# EAGLE design offset_rectifier (EAGLE 6.6.0)
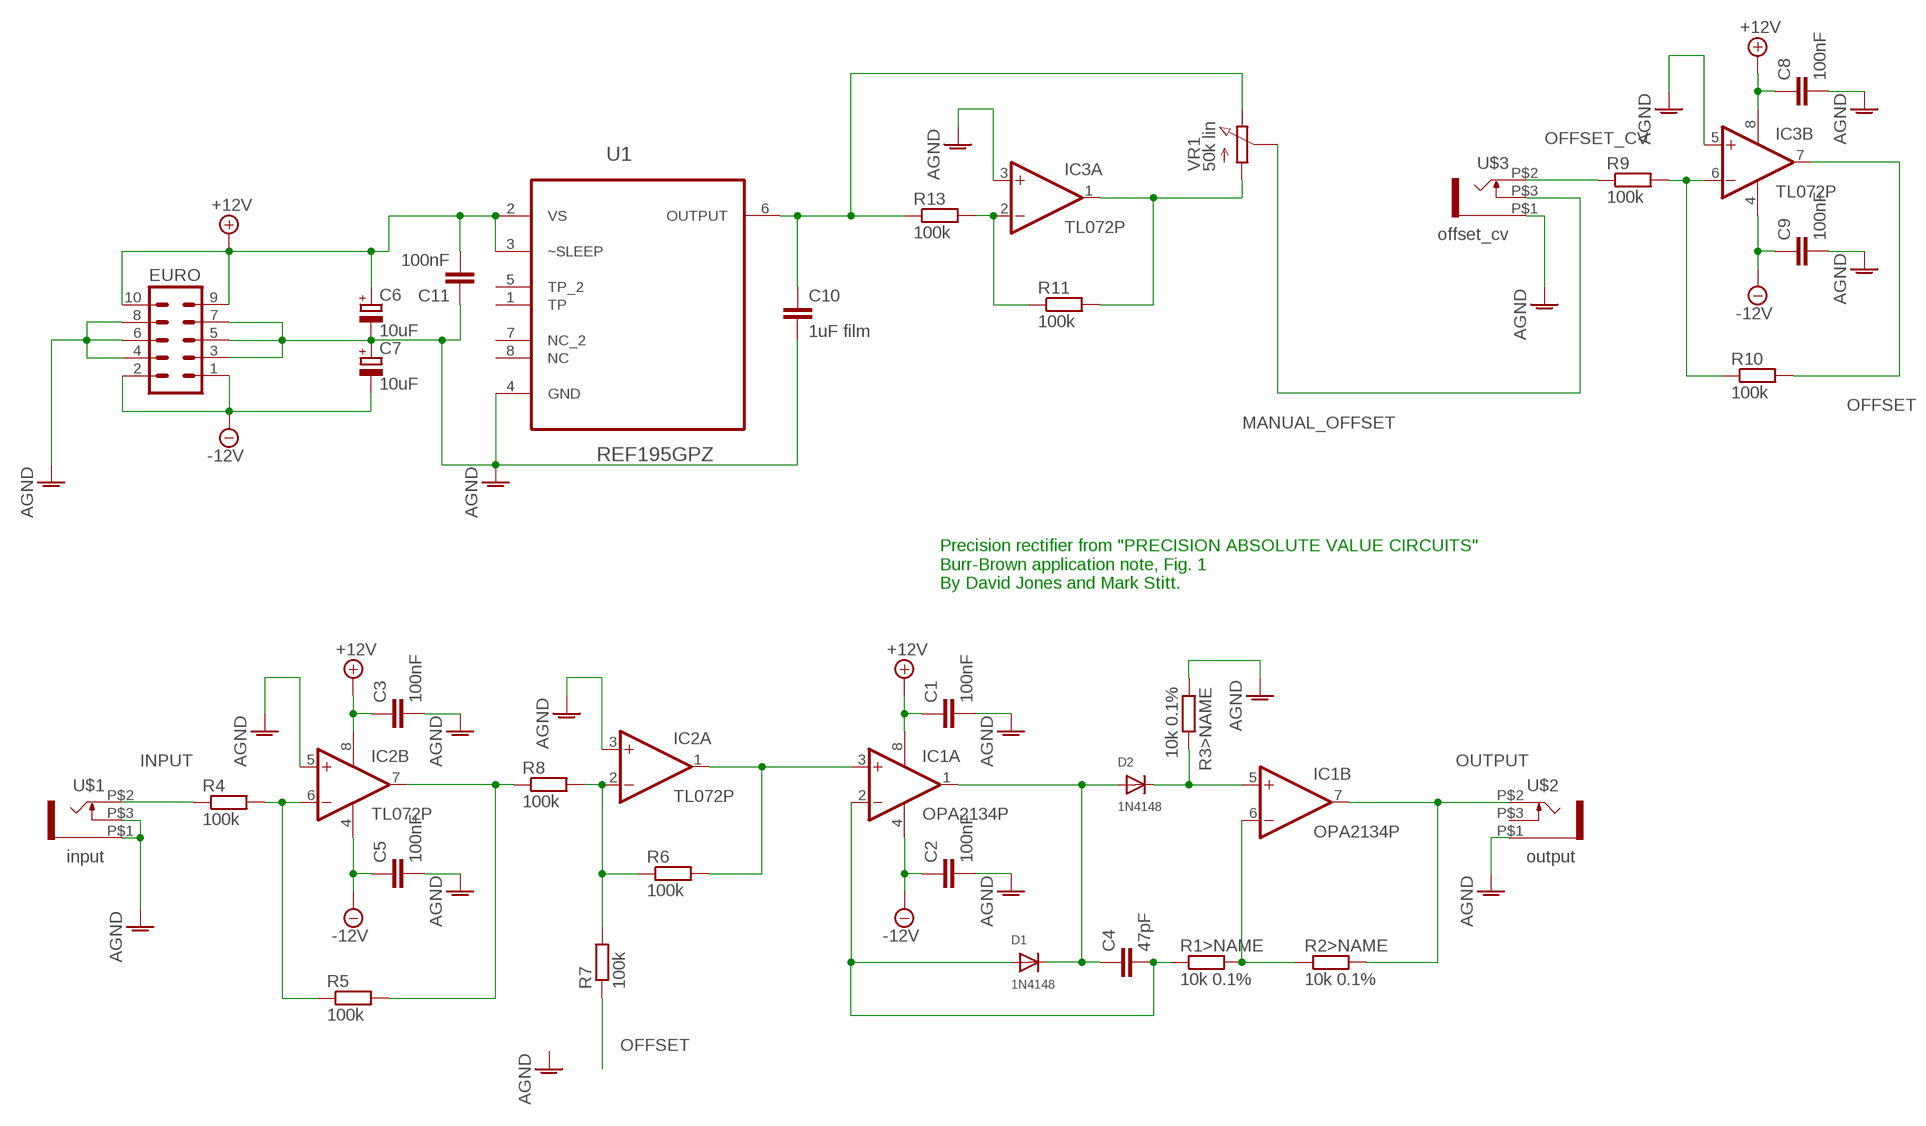
[diagram p0: schematic, sheet 1]

## Parts
C1  100nF  C2,5-3  [C2.5-3]
C2  100nF  C2,5-3  [C2.5-3]
C3  100nF  C2,5-3  [C2.5-3]
C4  47pF  C2,5-3  [C2.5-3]
C5  100nF  C2,5-3  [C2.5-3]
C6  10uF  CPOL-EUE2,5-6E  [E2,5-6E]
C7  10uF  CPOL-EUE2,5-6E  [E2,5-6E]
C8  100nF  C2,5-3  [C2.5-3]
C9  100nF  C2,5-3  [C2.5-3]
C10  1uF film  C-EU050-025X075  [C050-025X075]
C11  100nF  C2,5-3  [C2.5-3]
D1  1N4148  DIODEDO-1N4148  [DO-1N4148]
D2  1N4148  DIODEDO-1N4148  [DO-1N4148]
EURO  MA05-2  [MA05-2]
IC1  OPA2134P  [DIL08]
IC2  TL072P  [DIL08]
IC3  TL072P  [DIL08]
R1  10k 0.1%  WELWYN_PR5  [0409/12.5]
R2  10k 0.1%  WELWYN_PR5  [0409/12.5]
R3  10k 0.1%  WELWYN_PR5  [0409/12.5]
R4  100k  MULTICOMP_MF25  [02.5-06.8/10]
R5  100k  MULTICOMP_MF25  [02.5-06.8/10]
R6  100k  MULTICOMP_MF25  [02.5-06.8/10]
R7  100k  MULTICOMP_MF25  [02.5-06.8/10]
R8  100k  MULTICOMP_MF25  [02.5-06.8/10]
R9  100k  MULTICOMP_MF25  [02.5-06.8/10]
R10  100k  MULTICOMP_MF25  [02.5-06.8/10]
R11  100k  MULTICOMP_MF25  [02.5-06.8/10]
R13  100k  MULTICOMP_MF25  [02.5-06.8/10]
U1  REF195GPZ  [DIP254P762X533-8]
U$1  input  PJ302M-ROUND  [PJ302M]
U$2  output  PJ302M-ROUND  [PJ302M]
U$3  offset_cv  PJ302M-ROUND  [PJ302M]
VR1  50k lin  BI_P09X  [BI_9MM_SIDE]

## Nets
+12V: C1.1 C3.1 C6.+ C8.1 C11.2 EURO.9 EURO.10 IC1.8(P:V+) IC2.8(P:V+) IC3.8(P:V+) U1.2(VS) U1.3(~SLEEP)
-12V: C2.1 C5.1 C7.- C9.1 EURO.1 EURO.2 IC1.4(P:V-) IC2.4(P:V-) IC3.4(P:V-)
AGND: C1.2 C2.2 C3.2 C5.2 C6.- C7.+ C8.2 C9.2 C10.2 C11.1 EURO.3 EURO.4 EURO.5 EURO.6 EURO.7 EURO.8 IC2.3(A:+IN) IC2.5(B:+IN) IC3.3(A:+IN) IC3.5(B:+IN) R3.R$1 U1.4(GND) U$1.P$1(RING) U$1.P$3(SWITCH) U$2.P$1(RING) U$3.P$1(RING)
INPUT: R4.P$1 U$1.P$2(TIP)
MANUAL_OFFSET: U$3.P$3(SWITCH) VR1.WIPER
N$1: IC3.6(B:-IN) R9.P$2 R10.P$1
N$2: C4.2 D1.A IC1.2(A:-IN) R1.R$1
N$3: IC1.3(A:+IN) IC2.1(A:OUT) R6.P$2
N$4: D2.C IC1.5(B:+IN) R3.P$2
N$5: IC2.6(B:-IN) R4.P$2 R5.P$1
N$6: IC1.6(B:-IN) R1.P$2 R2.R$1
N$7: IC3.2(A:-IN) R11.P$1 R13.P$2
N$9: C4.1 D1.C D2.A IC1.1(A:OUT)
N$10: IC3.1(A:OUT) R11.P$2 VR1.BOTTOM
N$11: IC2.2(A:-IN) R6.P$1 R7.P$2 R8.P$2
N$12: IC2.7(B:OUT) R5.P$2 R8.P$1
N$14: C10.1 R13.P$1 U1.6(OUTPUT) VR1.TOP
OFFSET: IC3.7(B:OUT) R7.P$1 R10.P$2
OFFSET_CV: R9.P$1 U$3.P$2(TIP)
OUTPUT: IC1.7(B:OUT) R2.P$2 U$2.P$2(TIP)
Unconnected: U1.1(TP) U1.5(TP_2) U1.7(NC_2) U1.8(NC) U$2.P$3(SWITCH)

## Notes on the sheet
- Precision rectifier from "PRECISION ABSOLUTE VALUE CIRCUITS"
  Burr-Brown application note, Fig. 1
  By David Jones and Mark Stitt.

## Library data of the parts
C1-C5 C8 C9 C11 = capacitor-wima:C: CAPACITOR naming: grid - package width
C6 C7 = resistor:CPOL-EU: POLARIZED CAPACITOR, European symbol
C10 = resistor:C-EU: CAPACITOR, European symbol
D1 D2 = adafruit:DIODE: Diode SMADIODE - SMA Surface Mount Package 20V 1A Schottky Diode Digikey: 641-1014-6-ND DO-1N4148 - Through Hole Small Current Diode SOD-123 20V 1 A (.5mV Vf) Schottky Diode - Digikey: MBRX120TPMSCT-ND SOD-323 10V 570mA (.38mV Vf, 3ns) Schottky Diode - Digikey: ZLLS410CT-ND SOD-523 30V 30mA Schottky Diode (RB751S-40TE61) - Digikey: RB751S-40TE61CT-ND SOT23-R/W - SOT23 Package (R = Solder Paste/Reflow Ovens, W = Hand-Soldering) BAT54Film 40V 300mA - Digikey: 497-7162-1-ND
EURO = con-lstb:MA05-2: PIN HEADER; OC_FARNELL: unknown; OC_NEWARK: unknown
IC1 = linear:OPA2134: SoundPLUS (TM) High Performance AUDIO OPERATIONAL AMPLIFIERS Source: http://focus.ti.com/lit/ds/sbos058/sbos058.pdf
IC2 IC3 = linear:TL072: OP AMP
R1-R3 = resistors:WELWYN_PR5: Welwyn PR5Y series 0.1% 15ppm/°C metal film 0.5W resistor Farnell 1634076 Manufacturer PR5Y-xxxBI (PR5Y-10KBI for 10k)
R4-R11 R13 = resistors:MULTICOMP_MF25
U1 = Vrefs:REF195GPZ: Precision Micropower Low Dropout Voltage References; MPN: REF195GPZ; OC_FARNELL: 1438681; OC_NEWARK: 19M9001; PACKAGE: PDIP-8; SUPPLIER: Analog Devices
U$1-U$3 = thonkiconn:PJ302M-ROUND: Thonk PJ302M horizontal or right angled mount 3.5mm switching mono phone jack.
VR1 = potentiometers:BI_P09X: BI 9mm conductive plastic potentiometer right angled, single gang, 6mm shaft, bushing Mouser Part No: 858-P0915NEC15BR100K Manufacturer Part No: P0915N-EC15BR100K

## Board
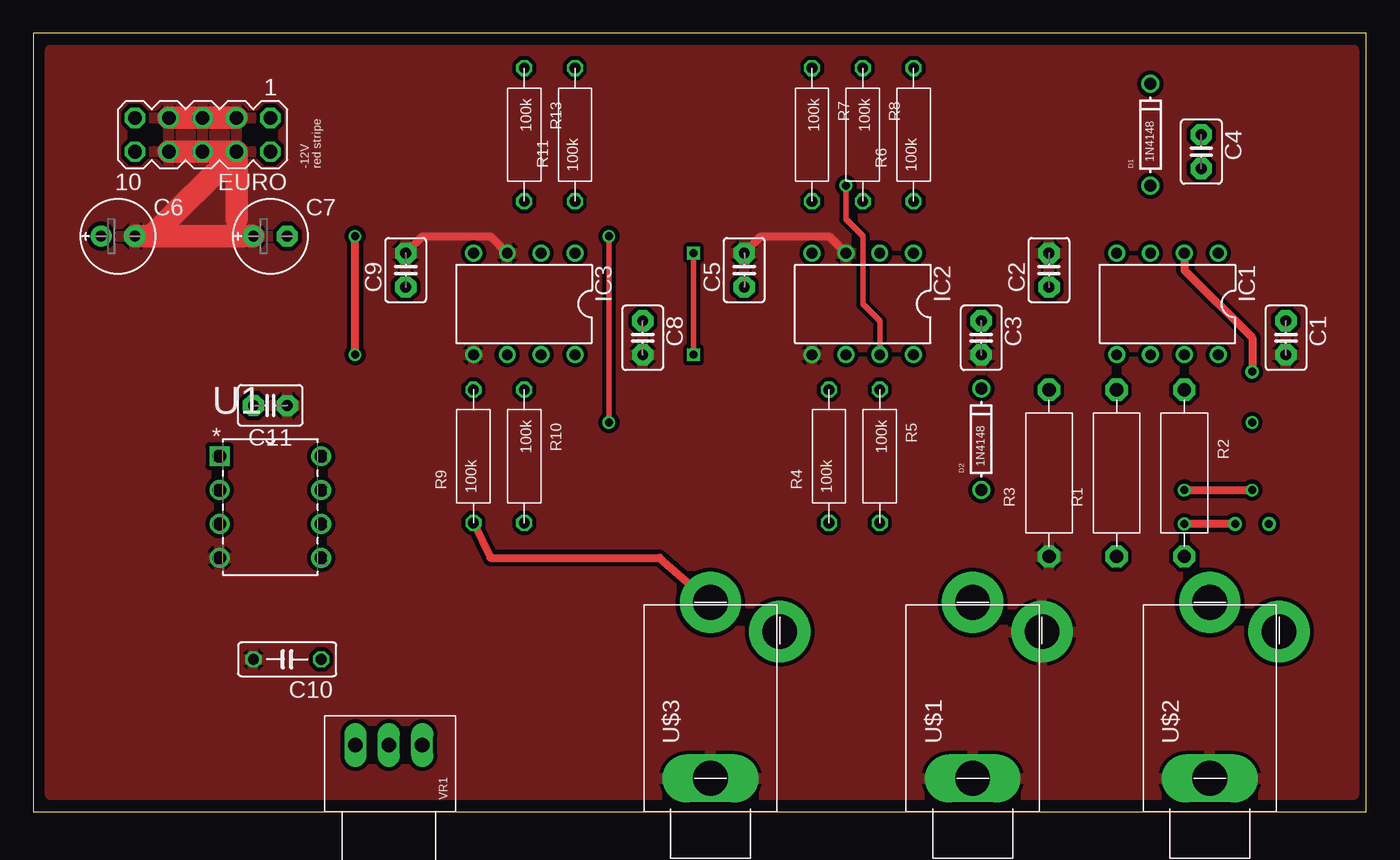
[diagram p1: board, top side]
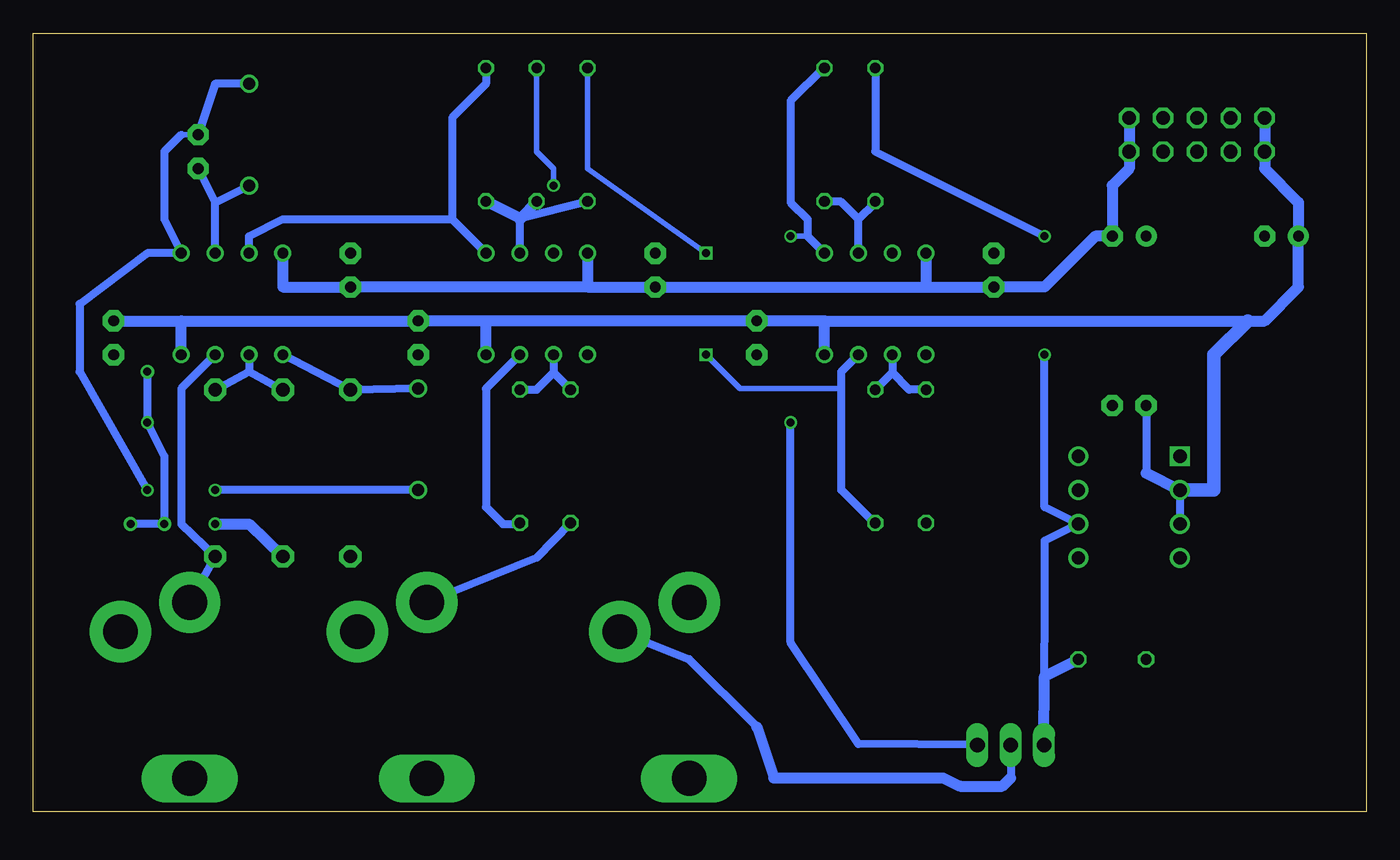
[diagram p2: board, bottom side, seen from below]

Size 100 x 58.41 mm. Coordinates in mm from the lower left corner, seen from the top.
Outline: 0,0 100,0 100,58.41 0,58.41 0,0
Copper layers (1*16): Top 0.0356mm / dielectric 1.5011mm / Bottom 0.0356mm
Design rules "oshpark-2layer": minimum track width 6mil, minimum drill 13mil, track to track 6mil, track to pad 6mil, pad to pad 6mil, via to via 6mil, smd to smd 6mil, copper to edge 15mil, drill to drill 6mil, minimum pad ring 7mil, minimum via ring 7mil, stop-mask expansion 4mil, vias tented up to drill 0mil, thermal gap 10mil

### Footprints (pad centres in the part's own frame; a part is rotated, then mirrored left to right if it is on the bottom)
C2.5-3 = drill 0.813 pad 1.6 octagon: 1 -1.27,0; 2 1.27,0
E2,5-6E = drill 0.813 pad 1.575: + -1.27,0 | drill 0.813 pad 1.575 octagon: - 1.27,0
C050-025X075 = drill 0.813 octagon: 1 -2.54,0; 2 2.54,0
DO-1N4148 = drill 0.9: A -3.81,0; C 3.81,0
MA05-2 = drill 1.016 octagon: 1 -5.08,-1.27; 2 -5.08,1.27; 3 -2.54,-1.27; 4 -2.54,1.27; 5 0,-1.27; 6 0,1.27; 7 2.54,-1.27; 8 2.54,1.27; 9 5.08,-1.27; 10 5.08,1.27
DIL08 = drill 0.813 pad 1.27: 1 -3.81,-3.81; 2 -1.27,-3.81; 3 1.27,-3.81; 4 3.81,-3.81; 5 3.81,3.81; 6 1.27,3.81; 7 -1.27,3.81; 8 -3.81,3.81
0409/12.5 = drill 1 pad 1.676 octagon: P$2 6.25,0; R$1 -6.25,0
02.5-06.8/10 = drill 0.8 octagon: P$1 -5,0; P$2 5,0
DIP254P762X533-8 = drill 0.991 square: 1 -7.62,7.62 | drill 0.991: 2 -7.62,5.08; 3 -7.62,2.54; 4 -7.62,0; 5 0,0; 6 0,2.54; 7 0,5.08; 8 0,7.62
PJ302M = drill 2.6 pad 3.6 long: P$1 2.5,0 | drill 2.6 pad 4.6: P$2 15.7,0; P$3 13.5,-5.2
BI_9MM_SIDE = drill 1.1 long: BOTTOM 5,-2.5; TOP 5,2.5; WIPER 5,0

### Placement (x,y rotation side)
C1  93.98,35.56 270 top
C2  76.2,40.64 90 top
C3  71.12,35.56 270 top
C4  87.63,49.53 270 top
C5  53.34,40.64 90 top
C6  6.35,43.18 0 top
C7  17.78,43.18 0 top
C8  45.72,35.56 270 top
C9  27.94,40.64 90 top
C10  19.05,11.43 180 top
C11  17.78,30.48 180 top
D1  83.82,50.8 90 top
D2  71.12,27.94 90 top
EURO  12.7,50.8 180 top
IC1  85.09,38.1 180 top
IC2  62.23,38.1 180 top
IC3  36.83,38.1 180 top
R1  81.28,25.4 90 top
R2  86.36,25.4 270 top
R3  76.2,25.4 90 top
R4  59.69,26.67 90 top
R5  63.5,26.67 270 top
R6  66.04,50.8 90 top
R7  58.42,50.8 270 top
R8  62.23,50.8 270 top
R9  33.02,26.67 90 top
R10  36.83,26.67 270 top
R11  40.64,50.8 90 top
R13  36.83,50.8 270 top
U1  21.59,19.05 0 top
U$1  70.48,0 90 top
U$2  88.27,0 90 top
U$3  50.8,0 90 top
VR1  26.67,0 90 top

### Tracks (layer width: path | path; a pad name or v marks a point on that pad's centre or on a via)
+12V
  Bottom 0.61: U1.2 U1.3 | C11.2 16.51,25.4
  Bottom 0.813: EURO.9 EURO.10 7.62,48.26 5.08,45.72 C6.+ 5.08,39.37 7.62,36.83 8.89,36.83 40.64,36.83 | 40.64,36.83 C8.1 66.04,36.83 | 66.04,36.83 C3.1 88.9,36.83 | C1.1 88.9,36.83 | IC1.8 88.9,36.83 | IC2.8 66.04,36.83 | IC3.8 40.64,36.83 | 16.51,25.4 U1.2
  Bottom 1.016: U1.2 11.43,24.13 11.43,34.29 8.89,36.83
-12V
  Bottom 0.813: EURO.1 EURO.2 17.78,48.26 19.05,46.99 C7.- 20.32,43.18 24.13,39.37 C9.1 33.02,39.37 | IC2.4 58.42,39.37 | 58.42,39.37 C5.1 33.02,39.37 | IC3.4 33.02,39.37 | IC1.4 81.28,39.37 C2.1 58.42,39.37
AGND
  Top 0.61: C5.2 54.61,43.18 59.69,43.18 IC2.3 | C9.2 29.21,43.18 34.29,43.18 IC3.3
  Top 1.676: EURO.8 EURO.6 EURO.4 | 8.89,43.18 EURO.4 | EURO.4 15.24,44.45 | EURO.7 EURO.5 EURO.3 | C7.+ C6.-
  pour Top (isolate 0.305): 99.06,1.27 1.27,1.27 1.27,57.15 99.06,57.15
INPUT
  Bottom 0.61: R4.P$1 62.23,19.05 U$1.P$2
MANUAL_OFFSET
  Bottom 0.61: VR1.WIPER 26.67,2.54 | 45.72,6.35 50.8,11.43 U$3.P$3
  Bottom 0.813: 45.72,6.35 44.45,2.54 31.75,2.54 30.48,1.91 27.3,1.91 26.67,2.54
N$1
  Bottom 0.61: IC3.6 35.56,32.94 | 35.56,32.94 R10.P$1 | R9.P$2 34.29,31.67 35.56,32.94
N$2  (via drill 0.6, 0.6 pad 1.02)
  Top 0.61: IC1.2 86.36,40.64 91.44,35.56 v91.44,33.02 | v90.17,21.59 v86.36,21.59
  Bottom 0.61: IC1.2 86.36,45.72 | 86.36,45.72 D1.A | C4.2 86.36,45.72 | v91.44,33.02 v91.44,29.21 90.17,26.67 v90.17,21.59 v92.71,21.59
  Bottom 0.813: v86.36,21.59 83.82,21.59 R1.R$1
N$3
  Bottom 0.61: R6.P$2 66.04,54.61 68.58,52.07 68.58,44.45 | 68.58,44.45 IC2.1 | IC1.3 83.82,43.18 81.28,44.45 68.58,44.45
N$4
  Bottom 0.61: D2.C R3.P$2 IC1.5
N$5
  Bottom 0.61: IC2.6 60.96,32.94 | 60.96,32.94 R4.P$2 | R5.P$1 62.23,31.67 60.96,32.94
N$6
  Bottom 0.61: IC1.6 83.82,33.02 | 83.82,33.02 R1.P$2 | R2.R$1 83.82,33.02
N$7
  Bottom 0.61: IC3.2 38.1,44.45 | 38.1,44.45 36.83,45.72 R13.P$2 | R11.P$1 39.45,45.8 38.1,44.45
N$9  (via drill 0.6)
  Top 0.61: v86.36,24.13 v91.44,24.13
  Bottom 0.406: C4.1 88.9,50.8
  Bottom 0.61: 88.9,50.8 90.17,49.53 90.17,44.45 IC1.1 91.44,41.91 96.52,38.1 96.52,33.02 v91.44,24.13 | D2.A v86.36,24.13 | D1.C 86.36,54.61 C4.1
N$10  (via drill 0.6)
  Top 0.406: v43.18,43.18 v43.18,29.21
  Bottom 0.406: 41.91,43.18 v43.18,43.18
  Bottom 0.61: R11.P$2 40.72,55.8 43.18,53.34 43.18,45.72 41.91,44.45 41.91,43.18 IC3.1 | VR1.BOTTOM 38.1,5.08 43.18,12.7 v43.18,29.21
N$11
  Bottom 0.61: IC2.2 63.5,44.45 63.5,44.53 R7.P$2
  Bottom 0.813: R6.P$1 63.5,44.53 | R8.P$2 63.5,44.45
N$12  (via drill 0.6)
  Top 0.406: IC2.7 63.5,36.83 62.23,38.1 62.23,43.18 60.96,44.45 v60.96,46.99
  Bottom 0.406: R8.P$1 62.23,49.53 60.96,48.26 v60.96,46.99
  Bottom 0.61: IC2.7 66.04,31.75 66.04,22.86 64.77,21.59 63.58,21.59 R5.P$2
N$14  (via drill 0.6)
  Top 0.61: v24.13,34.29 v24.13,43.18
  Bottom 0.61: VR1.TOP 24.13,20.32 U1.6 24.13,22.86 v24.13,34.29 | R13.P$1 36.83,49.53 v24.13,43.18
  Bottom 0.813: VR1.TOP 24.13,10.16 C10.1
OFFSET  (via drill 0.6)
  Top 0.406: v49.53,41.91 v49.53,34.29
  Bottom 0.406: 39.37,31.75 46.99,31.75 v49.53,34.29 | R7.P$1 58.42,48.26 v49.53,41.91
  Bottom 0.61: R10.P$2 36.91,21.67 39.37,24.13 39.37,31.75 39.37,33.02 IC3.7
OFFSET_CV
  Top 0.61: R9.P$1 34.29,19.05 46.99,19.05 U$3.P$2
OUTPUT
  Bottom 0.61: IC1.7 88.9,31.75 88.9,21.59 R2.P$2 U$2.P$2

### Text on the board
tPlace: -12V / red stripe